# Altium schematic sheet VUE_PIC32_v1_0_CAN.SchDoc: [VUE32 - CAN 2.0]
size A4; Engineer: JFDuval; Revision: 1.0
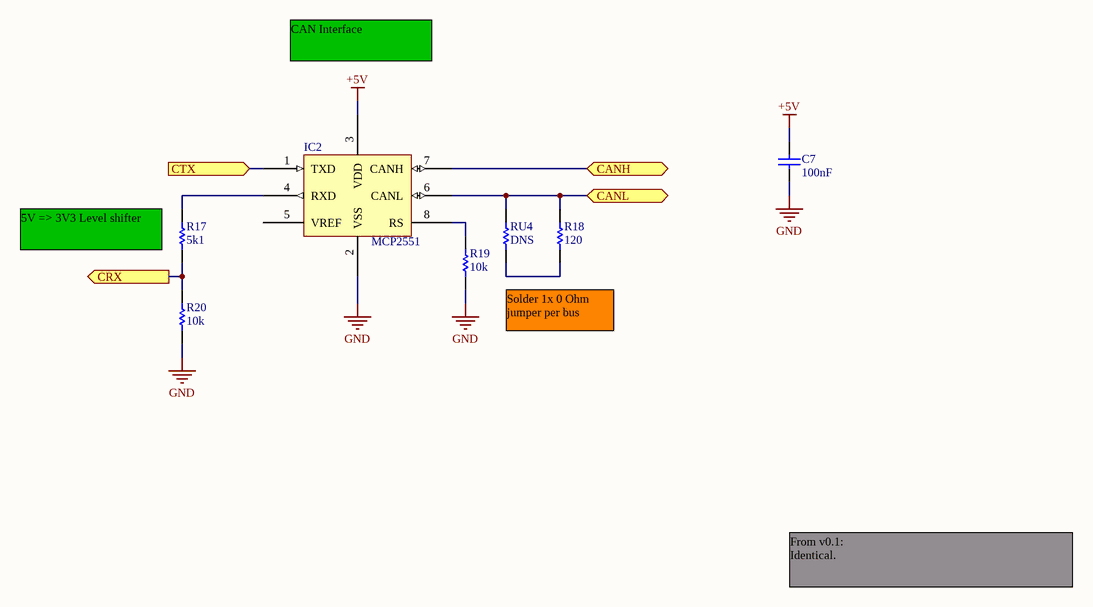
[diagram p0: VUE_PIC32_v1_0_CAN.SchDoc]

## Parts
C7  100nF  [0402C]
IC2  MCP2551  [SOIC-8]
R17  5k1  [0402]
R18  120  [0402]
R19  10k  [0402]
R20  10k  [0402]
RU4  DNS  [0603]

## Ports
CANH (bidir), CANL (bidir), CRX (out), CTX (in)

## Nets
+5V: C7.2 IC2.3(VDD)
GND: C7.1 IC2.2(VSS) R19.2 R20.1
CANH: IC2.7(CANH) ; port CANH
CANL: IC2.6(CANL) R18.2 RU4.2 ; port CANL
CRX: R17.1 R20.2 ; port CRX
CTX: IC2.1(TXD) ; port CTX
NetIC2_4: IC2.4(RXD) R17.2
NetIC2_8: IC2.8(RS) R19.1
NetR18_1: R18.1 RU4.1

Not connected (* = marked no-connect by the designer): IC2 5(VREF)

## Notes on the sheet
- CAN Interface
- (near R17) 5V => 3V3 Level shifter
- Solder 1x 0 Ohm jumper per bus
- From v0.1:
  Identical.

## Library data of the parts
C7 = CAP_TDK_C_0402_100nF_25V: CAP CER 0.1UF 25V Y5V 0402; MfgPartNumber: C1005Y5V1E104Z; Mfg: TDK; Value: 100nF; Digikey: 445-3445-1-ND
IC2 = IC_MICROCHIP_MCP2551_CAN_SOIC8: IC TRANSCEIVER CAN HI-SPD 8-SOIC; MfgPartNumber: MCP2551-I/SN; Mfg: Microchip Technology; Value: MCP2551; Digikey: MCP2551-I/SN-ND
R17 = RES_YAGEO_0402_5K1_1PCT: RES 5.10K OHM 1/16W 1% 0402 SMD; MfgPartNumber: RC0402FR-075K1L; Mfg: Yageo; Digikey: 311-5.10KLRCT-ND; Value: 5k1
R18 = RES_YAGEO_0402_120_1PCT: RES 120 OHM 1/16W 1% 0402 SMD; MfgPartNumber: RC0402FR-07120RL; Mfg: Yageo; Digikey: 311-120LRCT-ND; Value: 120
R19 R20 = RES_YAGEO_0402_10K_1PCT: RES 10.0K OHM 1/16W 1% 0402 SMD; MfgPartNumber: RC0402FR-0710KL; Mfg: Yageo; Value: 10k; Digikey: 311-10.0KLRCT-ND
RU4 = RES_DO_NOT_SOLDER_DNS_0603: Optional jumper - Do Not Solder; Mfg: NULL; MfgPartNumber: NULL; Digikey: NULL; Value: DNS